# EAGLE design module_SIM800C (EAGLE 9.0.1)
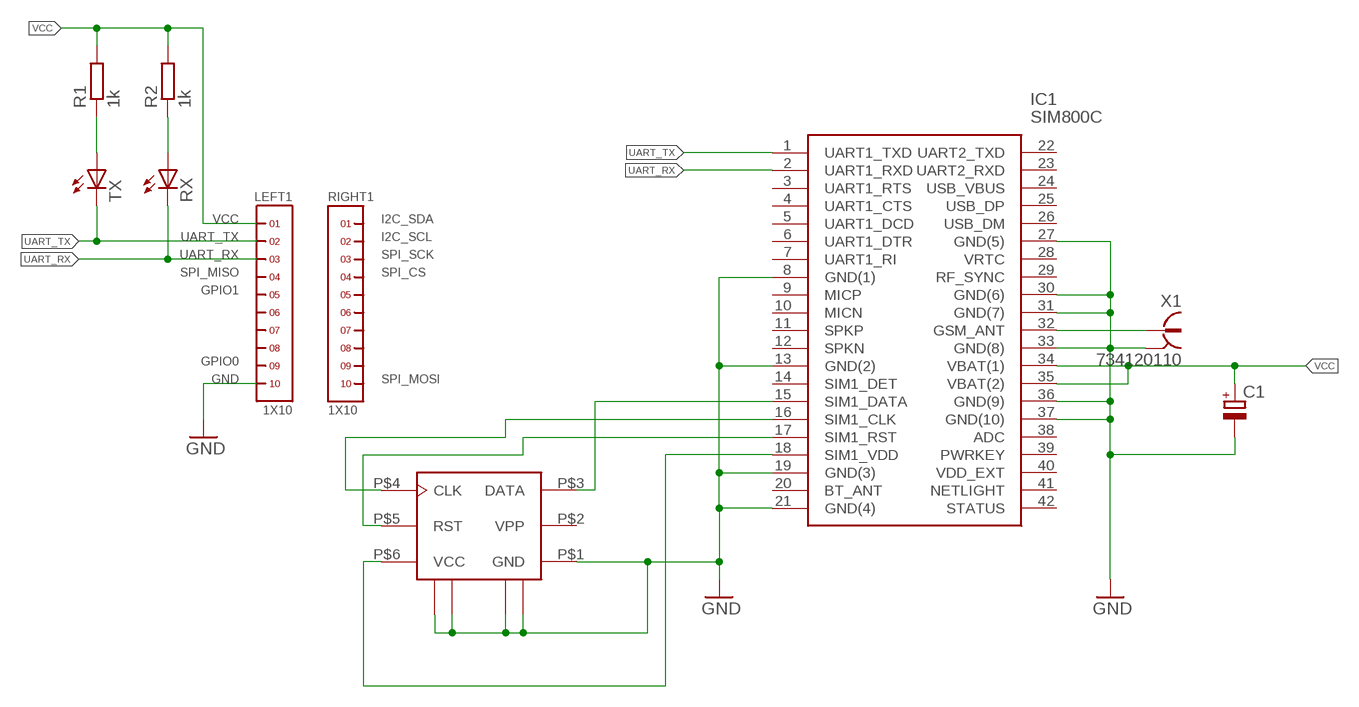
[diagram p0: schematic, sheet 1]

## Parts
C1  CPOL-EUSMCD  [SMC_D]
IC1  SIM800C  [SIM800C]
LEFT1  1X10  [1X10]
R1  1k  R-EU_R0603  [R0603]
R2  1k  R-EU_R0603  [R0603]
RIGHT1  1X10  [1X10]
RX  LEDCHIPLED_0603  [CHIPLED_0603]
TX  LEDCHIPLED_0603  [CHIPLED_0603]
U$1  C707-10M006-136-2  [C707-10M006-136-2]
X1  734120110  [734120110]

## Nets
GND: C1.- IC1.8(GND(1)) IC1.13(GND(2)) IC1.19(GND(3)) IC1.21(GND(4)) IC1.27(GND(5)) IC1.30(GND(6)) IC1.31(GND(7)) IC1.33(GND(8)) IC1.36(GND(9)) IC1.37(GND(10)) LEFT1.10 U$1.P$1(GND) U$1.P$7(GND1) U$1.P$8(GND2) U$1.P$9(GND3) U$1.P$10(GND4) X1.S@1 X1.S@2 X1.S@3
N$1: IC1.32(GSM_ANT) X1.1
N$2: R1.1 TX.A
N$3: R2.1 RX.A
N$4: IC1.15(SIM1_DATA) U$1.P$3(DATA)
N$5: IC1.16(SIM1_CLK) U$1.P$4(CLK)
N$6: IC1.17(SIM1_RST) U$1.P$5(RST)
N$7: IC1.18(SIM1_VDD) U$1.P$6(VCC)
UART_RX: IC1.2(UART1_RXD) LEFT1.3 RX.C
UART_TX: IC1.1(UART1_TXD) LEFT1.2 TX.C
VCC: C1.+ IC1.34(VBAT(1)) IC1.35(VBAT(2)) LEFT1.1 R1.2 R2.2
Unconnected: IC1.3(UART1_RTS) IC1.4(UART1_CTS) IC1.5(UART1_DCD) IC1.6(UART1_DTR) IC1.7(UART1_RI) IC1.9(MICP) IC1.10(MICN) IC1.11(SPKP) IC1.12(SPKN) IC1.14(SIM1_DET) IC1.20(BT_ANT) IC1.22(UART2_TXD) IC1.23(UART2_RXD) IC1.24(USB_VBUS) IC1.25(USB_DP) IC1.26(USB_DM) IC1.28(VRTC) IC1.29(RF_SYNC) IC1.38(ADC) IC1.39(PWRKEY) IC1.40(VDD_EXT) IC1.41(NETLIGHT) IC1.42(STATUS) LEFT1.4 LEFT1.5 LEFT1.6 LEFT1.7 LEFT1.8 LEFT1.9 RIGHT1.1 RIGHT1.2 RIGHT1.3 RIGHT1.4 RIGHT1.5 RIGHT1.6 RIGHT1.7 RIGHT1.8 RIGHT1.9 RIGHT1.10

## Notes on the sheet
- VCC | I2C_SDA
- UART_TX | I2C_SCL
- UART_RX | SPI_SCK
- SPI_MISO | SPI_CS
- GPIO1
- GPIO0
- GND | SPI_MOSI

## Power pins joined to a net without a drawn wire
VPP: U$1.P$2(VPP)

## Library data of the parts
C1 = rcl:CPOL-EU: POLARIZED CAPACITOR, European symbol
IC1 = sim800c:SIM800C: Quad-band GSM/GPRS wireless module Source: Datasheet <http://www.sabreadv.com/wp-content/uploads/SIM800C_Hardware_Design_V1.00.pdf>; DESCRIPTION: Quad-band GSM/GPRS wireless module; HEIGHT: mm; MANUFACTURER_NAME: SIMCOM; MANUFACTURER_PART_NUMBER: sim800c; SUPPLIER_NAME: RS
LEFT1 RIGHT1 = headers(2mm):1X10
R1 R2 = rcl:R-EU_: RESISTOR, European symbol; SPICEPREFIX: R
RX TX = led:LED: LED OSRAM: - CHIPLED LG R971, LG N971, LY N971, LG Q971, LY Q971, LO R971, LY R971 LH N974, LH R974 LS Q976, LO Q976, LY Q976 LO Q996 - Hyper CHIPLED LW Q18S LB Q993, LB Q99A, LB R99A - SideLED LS A670, LO A670, LY A670, LG A670, LP A670 LB A673, LV A673, LT A673, LW A673 LH A674 LY A675 LS A676, LA A676, LO A676, LY A676, LW A676 LS A679, LY A679, LG A679 - Hyper Micro SIDELED® LS Y876, LA Y876, LO Y876, LY Y876 LT Y87S - SmartLED LW L88C, LW L88S LB L89C, LB L89S, LG L890 LS L89K, LO L89K, LY L89K LS L896, LA L896, LO L896, LY L896 - TOPLED LS T670, LO T670, LY T670, LG T670, LP T670 LSG T670, LSP T670, LSY T670, LOP T670, LYG T670 LG T671, LOG T671, LSG T671 LB T673, LV T673, LT T673, LW T673 LH T674 LS T676, LA T676, LO T676, LY T676, LB T676, LH T676, LSB T676, LW T676 LB T67C, LV T67C, LT T67C, LS T67K, LO T67K, LY T67K, LW E67C LS E67B, LA E67B, LO E67B, LY E67B, LB E67C, LV E67C, LT E67C LW T67C LS T679, LY T679, LG T679 LS T770, LO T770, LY T770, LG T770, LP T770 LB T773, LV T773, LT T773, LW T773 LH T774 LS E675, LA E675, LY E675, LS T675 LS T776, LA T776, LO T776, LY T776, LB T776 LHGB T686 LT T68C, LB T68C - Hyper Mini TOPLED® LB M676 - Mini TOPLED Santana® LG M470 LS M47K, LO M47K, LY M47K Source: http://www.osram.convergy.de LUXEON: - LUMILED® LXK2-PW12-R00, LXK2-PW12-S00, LXK2-PW14-U00, LXK2-PW14-V00 LXK2-PM12-R00, LXK2-PM12-S00, LXK2-PM14-U00 LXK2-PE12-Q00, LXK2-PE12-R00, LXK2-PE12-S00, LXK2-PE14-T00, LXK2-PE14-U00 LXK2-PB12-K00, LXK2-PB12-L00, LXK2-PB12-M00, LXK2-PB14-N00, LXK2-PB14-P00, LXK2-PB14-Q00 LXK2-PR12-L00, LXK2-PR12-M00, LXK2-PR14-Q00, LXK2-PR14-R00 LXK2-PD12-Q00, LXK2-PD12-R00, LXK2-PD12-S00 LXK2-PH12-R00, LXK2-PH12-S00 LXK2-PL12-P00, LXK2-PL12-Q00, LXK2-PL12-R00 Source: www.luxeon.com KINGBRIGHT: KA-3528ASYC Source: www.kingbright.com
U$1 = con-sim:C707-10M006-136-2
X1 = con-coax:734120110: MICRO COAXIAL CONNECTOR RECEPTACLE VERTICAL Source: Data sheet <http://www.molex.com/pdm_docs/sd/734120110_sd.pdf>

## Board
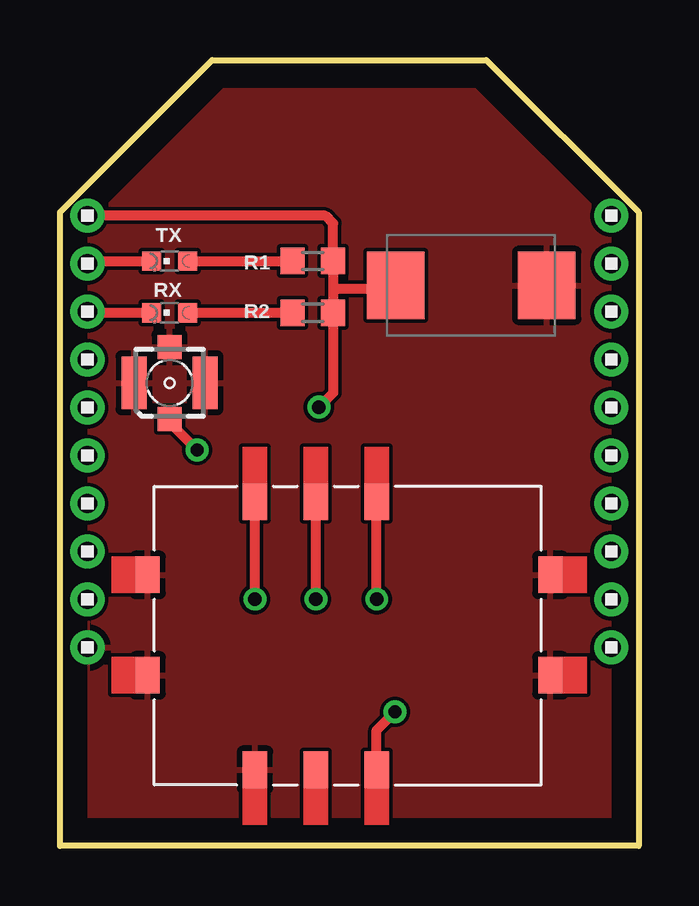
[diagram p1: board, top side]
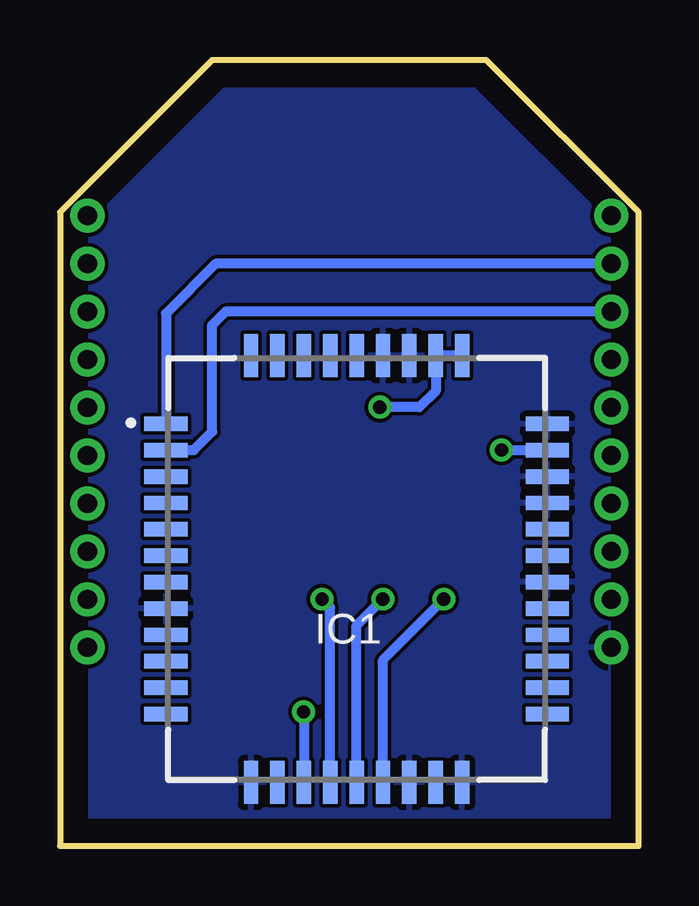
[diagram p2: board, bottom side, seen from below]

Size 24.13 x 32.77 mm. Coordinates in mm from the lower left corner, seen from the top.
Outline: 0,0 0,26.42 6.35,32.77 17.78,32.77 24.13,26.42 24.13,0 0,0
Copper layers (1*16): Top 0.035mm / dielectric 1.5mm / Bottom 0.035mm
Design rules "default": minimum track width 6mil, minimum drill 0.35mm, track to track 6mil, track to pad 6mil, pad to pad 6mil, via to via 6mil, smd to smd 6mil, copper to edge 40mil, drill to drill 6mil, minimum pad ring 10mil, minimum via ring 8mil, stop-mask expansion 4mil, vias tented up to drill 0mil, thermal gap 10mil

### Footprints (pad centres in the part's own frame; a part is rotated, then mirrored left to right if it is on the bottom)
SMC_D = smd 2.4 x 2.8: + -3.15,0; - 3.15,0
SIM800C = smd 1.8 x 0.6: 1 -7.95,6.05; 2 -7.95,4.95; 3 -7.95,3.85; 4 -7.95,2.75; 5 -7.95,1.65; 6 -7.95,0.55; 7 -7.95,-0.55; 8 -7.95,-1.65; 9 -7.95,-2.75; 10 -7.95,-3.85; 11 -7.95,-4.95; 12 -7.95,-6.05; 22 7.95,-6.05; 23 7.95,-4.95; 24 7.95,-3.85; 25 7.95,-2.75; 26 7.95,-1.65; 27 7.95,-0.55; 28 7.95,0.55; 29 7.95,1.65; 30 7.95,2.75; 31 7.95,3.85; 32 7.95,4.95; 33 7.95,6.05 | smd 0.6 x 1.8: 13 -4.4,-8.9; 14 -3.3,-8.9; 15 -2.2,-8.9; 16 -1.1,-8.9; 17 0,-8.9; 18 1.1,-8.9; 19 2.2,-8.9; 20 3.3,-8.9; 21 4.4,-8.9; 34 4.4,8.9; 35 3.3,8.9; 36 2.2,8.9; 37 1.1,8.9; 38 0,8.9; 39 -1.1,8.9; 40 -2.2,8.9; 41 -3.3,8.9; 42 -4.4,8.9
1X10 = drill 0.8 pad 1.422: 1 -9,0; 2 -7,0; 3 -5,0; 4 -3,0; 5 -1,0; 6 1,0; 7 3,0; 8 5,0; 9 7,0; 10 9,0
R0603 = smd 1 x 1.1: 1 -0.85,0; 2 0.85,0
CHIPLED_0603 = smd 0.8 x 0.8: A 0,-0.75; C 0,0.75
C707-10M006-136-2 = smd 1.524 x 1.016: P$1 -5.588,2.54; P$2 -5.588,0; P$3 -5.588,-2.54; P$4 5.588,-2.54; P$5 5.588,0; P$6 5.588,2.54; P$7 -1.651,7.01; P$8 2.54,7.01; P$9 -1.651,-9.779; P$10 2.54,-9.779
734120110 = smd 1 x 1: 1 0,-1.5; S@1 0,1.5 | smd 1.05 x 2.2: S@2 -1.475,0; S@3 1.475,0

### Placement (x,y rotation side)
C1  17.14,23.37 0 top
IC1  11.76,11.55 0 bottom
LEFT1  1.14,17.27 270 top
R1  10.54,24.38 0 top
R2  10.54,22.23 0 top
RIGHT1  22.99,17.27 270 top
RX  4.57,22.23 90 top
TX  4.57,24.38 90 top
U$1  10.67,8.76 90 top
X1  4.57,19.3 0 top

### Tracks (layer width: path | path; a pad name or v marks a point on that pad's centre or on a via)
GND
  pour Bottom: -0.51,-0.51 -0.51,26.67 6.1,33.27 18.03,33.27 24.64,26.67 24.64,-0.51
  pour Top: -0.25,-0.25 -0.25,26.54 6.22,33.02 17.91,33.02 24.38,26.54 24.38,-0.25
N$1  (via drill 0.55)
  Top 0.406: v5.71,16.51 4.57,17.65 X1.1
  Bottom 0.254: 3.82,16.51 IC1.32
  Bottom 0.406: v5.71,16.51 3.82,16.51
N$2
  Top 0.406: TX.A R1.1
N$3
  Top 0.406: RX.A R2.1
N$4  (via drill 0.55)
  Top 0.406: U$1.P$3 13.21,4.83 v13.97,5.59
  Bottom 0.406: v13.97,5.59 13.96,5.58 IC1.15
N$5  (via drill 0.55)
  Top 0.406: v13.21,10.29 U$1.P$4
  Bottom 0.406: IC1.16 12.86,9.94 v13.21,10.29
N$6  (via drill 0.55)
  Top 0.406: v10.67,10.29 U$1.P$5
  Bottom 0.406: IC1.17 11.76,9.19 v10.67,10.29
N$7  (via drill 0.55)
  Top 0.406: v8.13,10.29 U$1.P$6
  Bottom 0.406: IC1.18 10.66,7.75 v8.13,10.29
UART_RX
  Top 0.254: LEFT1.3 1.19,22.23
  Top 0.406: 1.19,22.23 RX.C
  Bottom 0.406: LEFT1.3 17.23,22.27 17.78,21.72 17.78,17.27 18.55,16.5 IC1.2
UART_TX
  Top 0.254: LEFT1.2 1.25,24.38
  Top 0.406: 1.25,24.38 TX.C
  Bottom 0.406: IC1.1 19.71,22.2 17.64,24.27 LEFT1.2
VCC  (via drill 0.55)
  Top 0.406: 11.39,23.24 R1.2 11.39,25.95 11.07,26.27 LEFT1.1 | 11.39,23.24 R2.2 11.39,18.88 v10.79,18.29 | 11.39,23.24 13.99,23.24 C1.+
  Bottom 0.406: IC1.34 IC1.35 8.46,18.97 9.14,18.29 v10.79,18.29

### Text on the board
_tDocu: PWR: / LOG: | 3.3 V / 3.3 V | SIM800C